# EAGLE design Oscillator (EAGLE 6.3)
Colpitts Oscillator with Amplifier By: Abdallah Ali Abdallah Date: 2014 Licence: CC-BY-V4
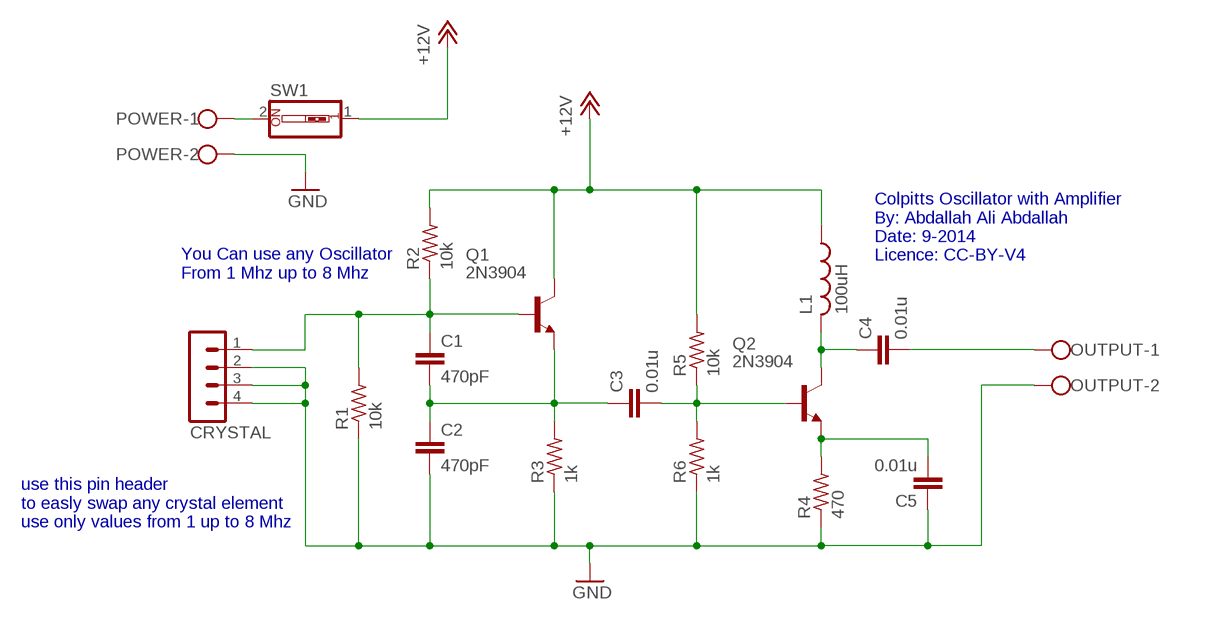
[diagram p0: schematic, sheet 1]

## Parts
C1  470pF  C-EU025-025X050  [C025-025X050]
C2  470pF  C-EU025-025X050  [C025-025X050]
C3  0.01u  C-EU025-025X050  [C025-025X050]
C4  0.01u  C-EU025-025X050  [C025-025X050]
C5  0.01u  C-EU025-025X050  [C025-025X050]
CRYSTAL  MA04-1  [MA04-1]
L1  100uH  L-US0204/7  [0204/7]
OUTPUT  W237-102  [W237-102]
POWER  W237-102  [W237-102]
Q1  2N3904  [TO92]
Q2  2N3904  [TO92]
R1  10k  R-US_0204/7  [0204/7]
R2  10k  R-US_0204/7  [0204/7]
R3  1k  R-US_0204/7  [0204/7]
R4  470  R-US_0204/7  [0204/7]
R5  10k  R-US_0204/7  [0204/7]
R6  1k  R-US_0204/7  [0204/7]
SW1  SW_DIP-1  [EDG-01]

## Nets
+12V: L1.1 Q1.1(C) R2.2 R5.2 SW1.1
GND: C2.2 C5.1 CRYSTAL.2 CRYSTAL.3 CRYSTAL.4 OUTPUT.2 POWER.2 R1.1 R3.1 R4.1 R6.1
N$1: C1.1 CRYSTAL.1 Q1.2(B) R1.2 R2.1
N$2: C1.2 C2.1 C3.1 Q1.3(E) R3.2
N$3: C3.2 Q2.2(B) R5.1 R6.2
N$5: C5.2 Q2.3(E) R4.2
N$6: C4.1 L1.2 Q2.1(C)
N$9: C4.2 OUTPUT.1
N$11: POWER.1 SW1.2

## Notes on the sheet
- Colpitts Oscillator with Amplifier
  By: Abdallah Ali Abdallah
  Date: 9-2014
  Licence: CC-BY-V4
- You Can use any Oscillator 
  From 1 Mhz up to 8 Mhz
- use this pin header
  to easly swap any crystal element
  use only values from 1 up to 8 Mhz

## Library data of the parts
C1-C5 = rcl:C-EU: CAPACITOR, European symbol
CRYSTAL = con-lstb:MA04-1: PIN HEADER; OC_FARNELL: unknown; OC_NEWARK: unknown
L1 = rcl:L-US: INDUCTOR, American symbol
OUTPUT POWER = con-wago-500:W237-102: WAGO SCREW CLAMP; MPN: 237-102; OC_FARNELL: unknown; OC_NEWARK: 70K9898
Q1 Q2 = transistor-npn:2N3904: NPN Transistor
R1-R6 = rcl:R-US_: RESISTOR, American symbol
SW1 = special:SW_DIP-1: DIP SWITCH

## Board
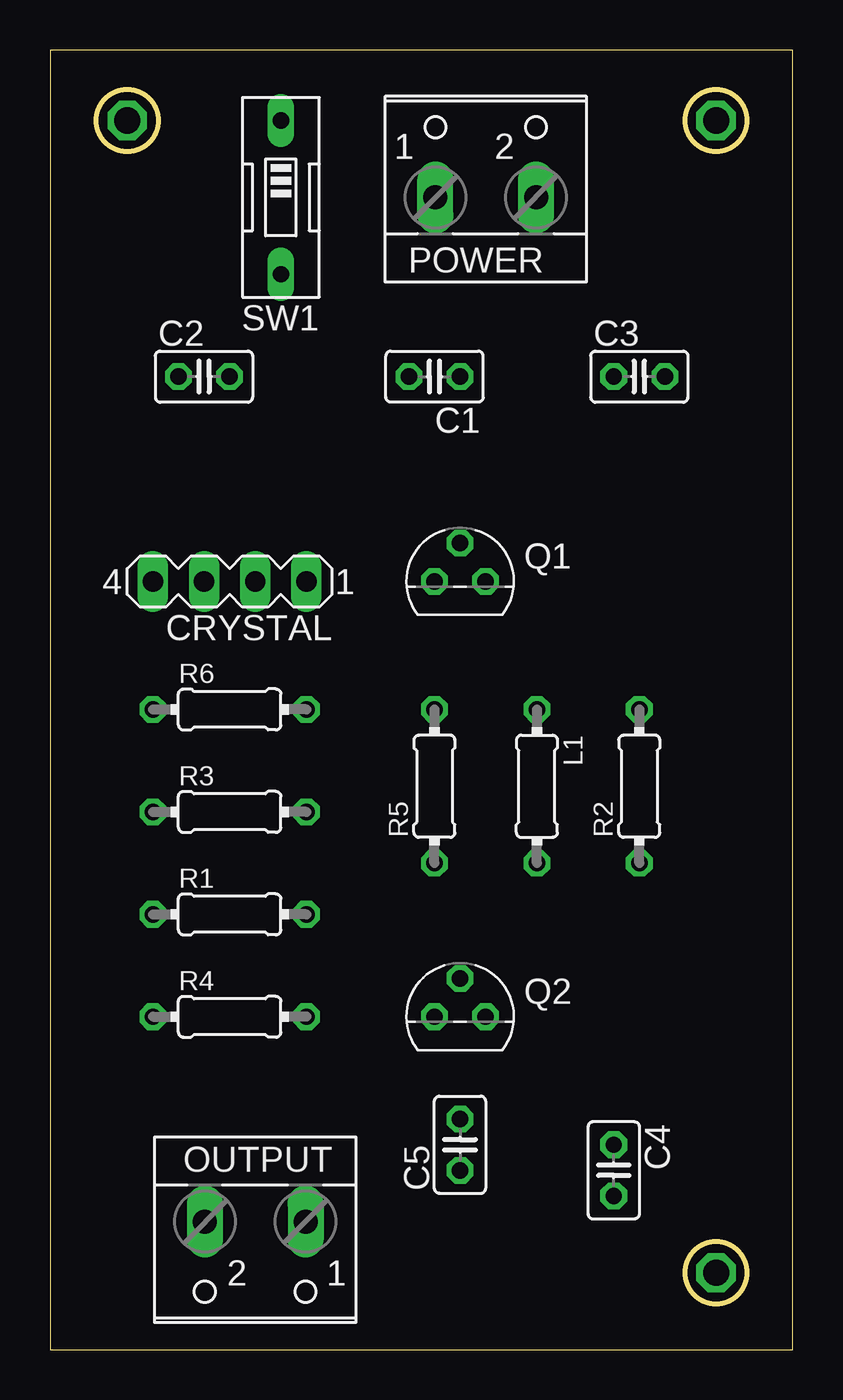
[diagram p1: board, top side]
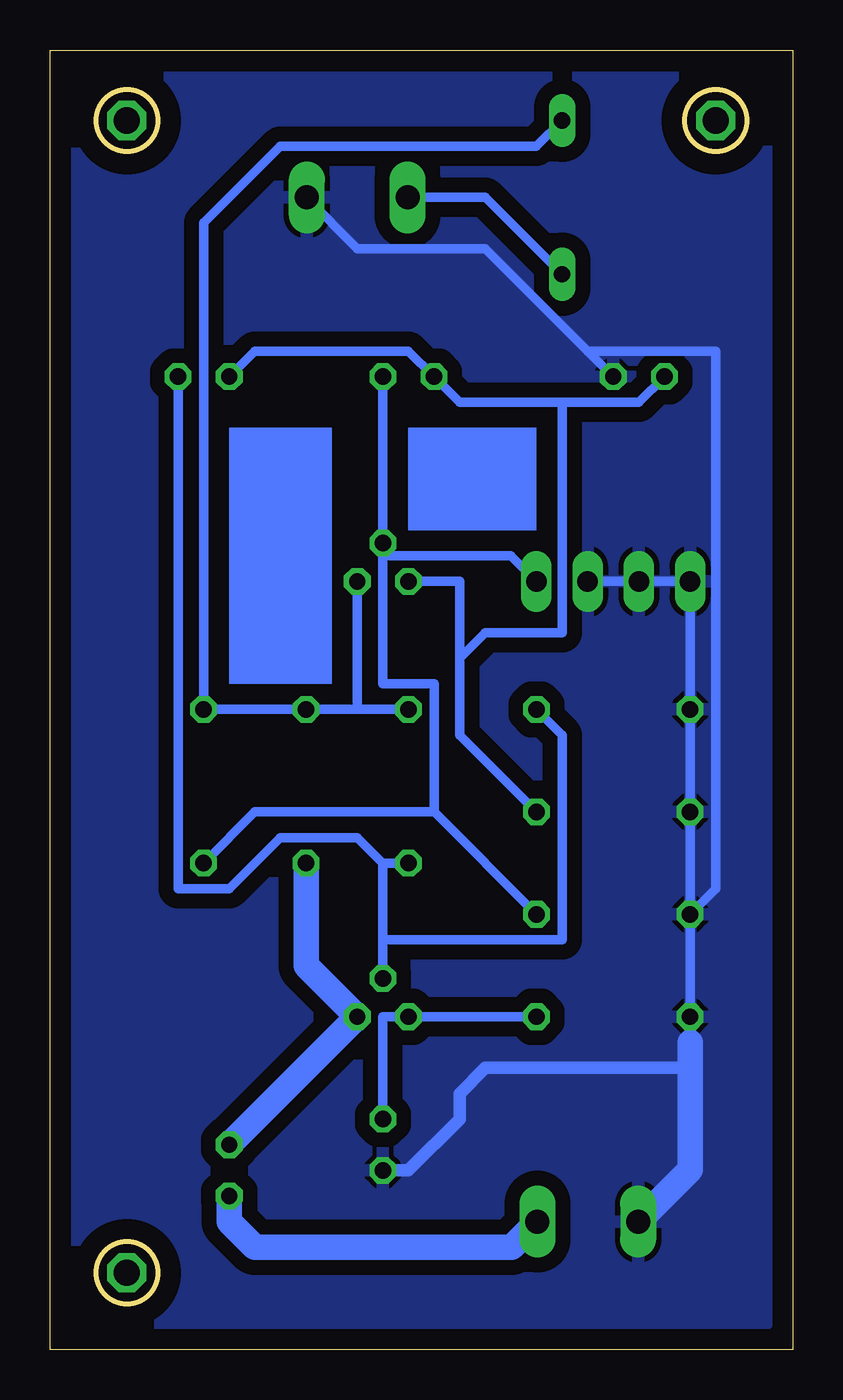
[diagram p2: board, bottom side, seen from below]

Size 36.81 x 64.44 mm. Coordinates in mm from the lower left corner, seen from the top.
Outline: 0,0 36.81,0 36.81,64.44 0,64.44 0,0
Outline: circle at 3.81,60.96 radius 1.52
Outline: circle at 33.02,3.81 radius 1.52
Outline: circle at 33.02,60.96 radius 1.52
Copper layers (1*16): Top 0.035mm / dielectric 1.5mm / Bottom 0.035mm
Design rules "default *": minimum track width 19mil, minimum drill 24mil, track to track 10mil, track to pad 10mil, pad to pad 8mil, via to via 8mil, smd to smd 8mil, copper to edge 40mil, drill to drill 8mil, minimum pad ring 10mil, minimum via ring 8mil, stop-mask expansion 4mil, vias tented up to drill 0mil, thermal gap 10mil

### Footprints (pad centres in the part's own frame; a part is rotated, then mirrored left to right if it is on the bottom)
C025-025X050 = drill 0.813 octagon: 1 -1.27,0; 2 1.27,0
MA04-1 = drill 1.016 long: 1 -3.81,0; 2 -1.27,0; 3 1.27,0; 4 3.81,0
0204/7 = drill 0.813 octagon: 1 -3.81,0; 2 3.81,0
W237-102 = drill 1.194 long: 1 -2.5,-1.27; 2 2.5,-1.27
TO92 = drill 0.813 octagon: 1 1.27,0; 2 0,1.905; 3 -1.27,0
EDG-01 = drill 0.813 long: 1 0,-3.81; 2 0,3.81

### Placement (x,y rotation side)
C1  19.05,48.26 180 top
C2  7.62,48.26 0 top
C3  29.21,48.26 0 top
C4  27.94,8.89 270 top
C5  20.32,10.16 90 top
CRYSTAL  8.89,38.1 180 top
L1  24.13,27.94 270 top
OUTPUT  10.16,5.08 180 top
POWER  21.59,58.42 0 top
Q1  20.32,38.1 0 top
Q2  20.32,16.51 0 top
R1  8.89,21.59 0 top
R2  29.21,27.94 90 top
R3  8.89,26.67 0 top
R4  8.89,16.51 0 top
R5  19.05,27.94 90 top
R6  8.89,31.75 0 top
SW1  11.43,57.15 180 top

### Tracks (layer width: path | path; a pad name or v marks a point on that pad's centre or on a via)
+12V
  Bottom 0.483: 21.59,31.75 L1.1 R2.2 29.21,55.88 25.4,59.69 12.7,59.69 SW1.1 | 21.59,31.75 R5.2 | 21.59,31.75 Q1.1
GND
  Bottom 0.483: R1.1 R3.1 R6.1 CRYSTAL.4 CRYSTAL.3 CRYSTAL.2 | R1.1 R4.1 5.08,15.24 | 10.16,49.53 15.24,54.61 21.59,54.61 24.13,57.15 POWER.2 | 10.16,49.53 C2.2 | R1.1 3.81,22.86 3.81,49.53 10.16,49.53
  Bottom 0.61: C5.1 19.05,8.89 16.51,11.43 16.51,12.7 15.24,13.97 5.08,13.97
  Bottom 1.27: 5.08,15.24 5.08,13.97 5.08,8.93 OUTPUT.2
  pour Bottom (isolate 0.737): 1.27,1.27 35.56,1.27 35.56,62.23 35.56,63.5 1.27,63.5
N$1
  Bottom 0.483: C1.1 Q1.2 20.32,39.37 | 20.32,39.37 13.97,39.37 CRYSTAL.1 | 17.78,26.67 R1.2 | 17.78,26.67 26.67,26.67 R2.1 | 20.32,39.37 20.32,33.02 17.78,33.02 17.78,26.67
N$2
  Bottom 0.483: R3.2 16.51,30.48 16.51,34.29 | 16.51,34.29 16.51,38.1 Q1.3 | C2.1 7.62,46.99 11.43,46.99 | 11.43,46.99 16.51,46.99 C1.2 19.05,49.53 26.67,49.53 C3.1 | 16.51,34.29 15.24,35.56 11.43,35.56 11.43,46.99
N$3
  Bottom 0.483: 20.32,24.13 20.32,20.32 | 20.32,20.32 Q2.2 | R5.1 20.32,24.13 | R6.2 11.43,30.48 11.43,20.32 20.32,20.32 | C3.2 30.48,22.86 27.94,22.86 25.4,25.4 21.59,25.4 20.32,24.13
N$4  (via drill 1.3)
  other vias: 33.02,3.81
N$5
  Bottom 0.483: R4.2 Q2.3 20.32,16.51 C5.2
N$6
  Bottom 1.27: C4.1 Q2.1 24.13,19.05 L1.2
N$7  (via drill 1.3)
  other vias: 33.02,60.96
N$8  (via drill 1.3)
  other vias: 3.81,60.96
N$9
  Bottom 1.27: C4.2 27.94,6.35 26.67,5.08 13.93,5.08 OUTPUT.1
N$11
  Bottom 0.483: SW1.2 15.24,57.15 POWER.1
(copper drawn outside any net)
  shapes: Bottom area x2